# EAGLE schematic IRcircuit (EAGLE 9.4.0)

## Sheet 1 of 2
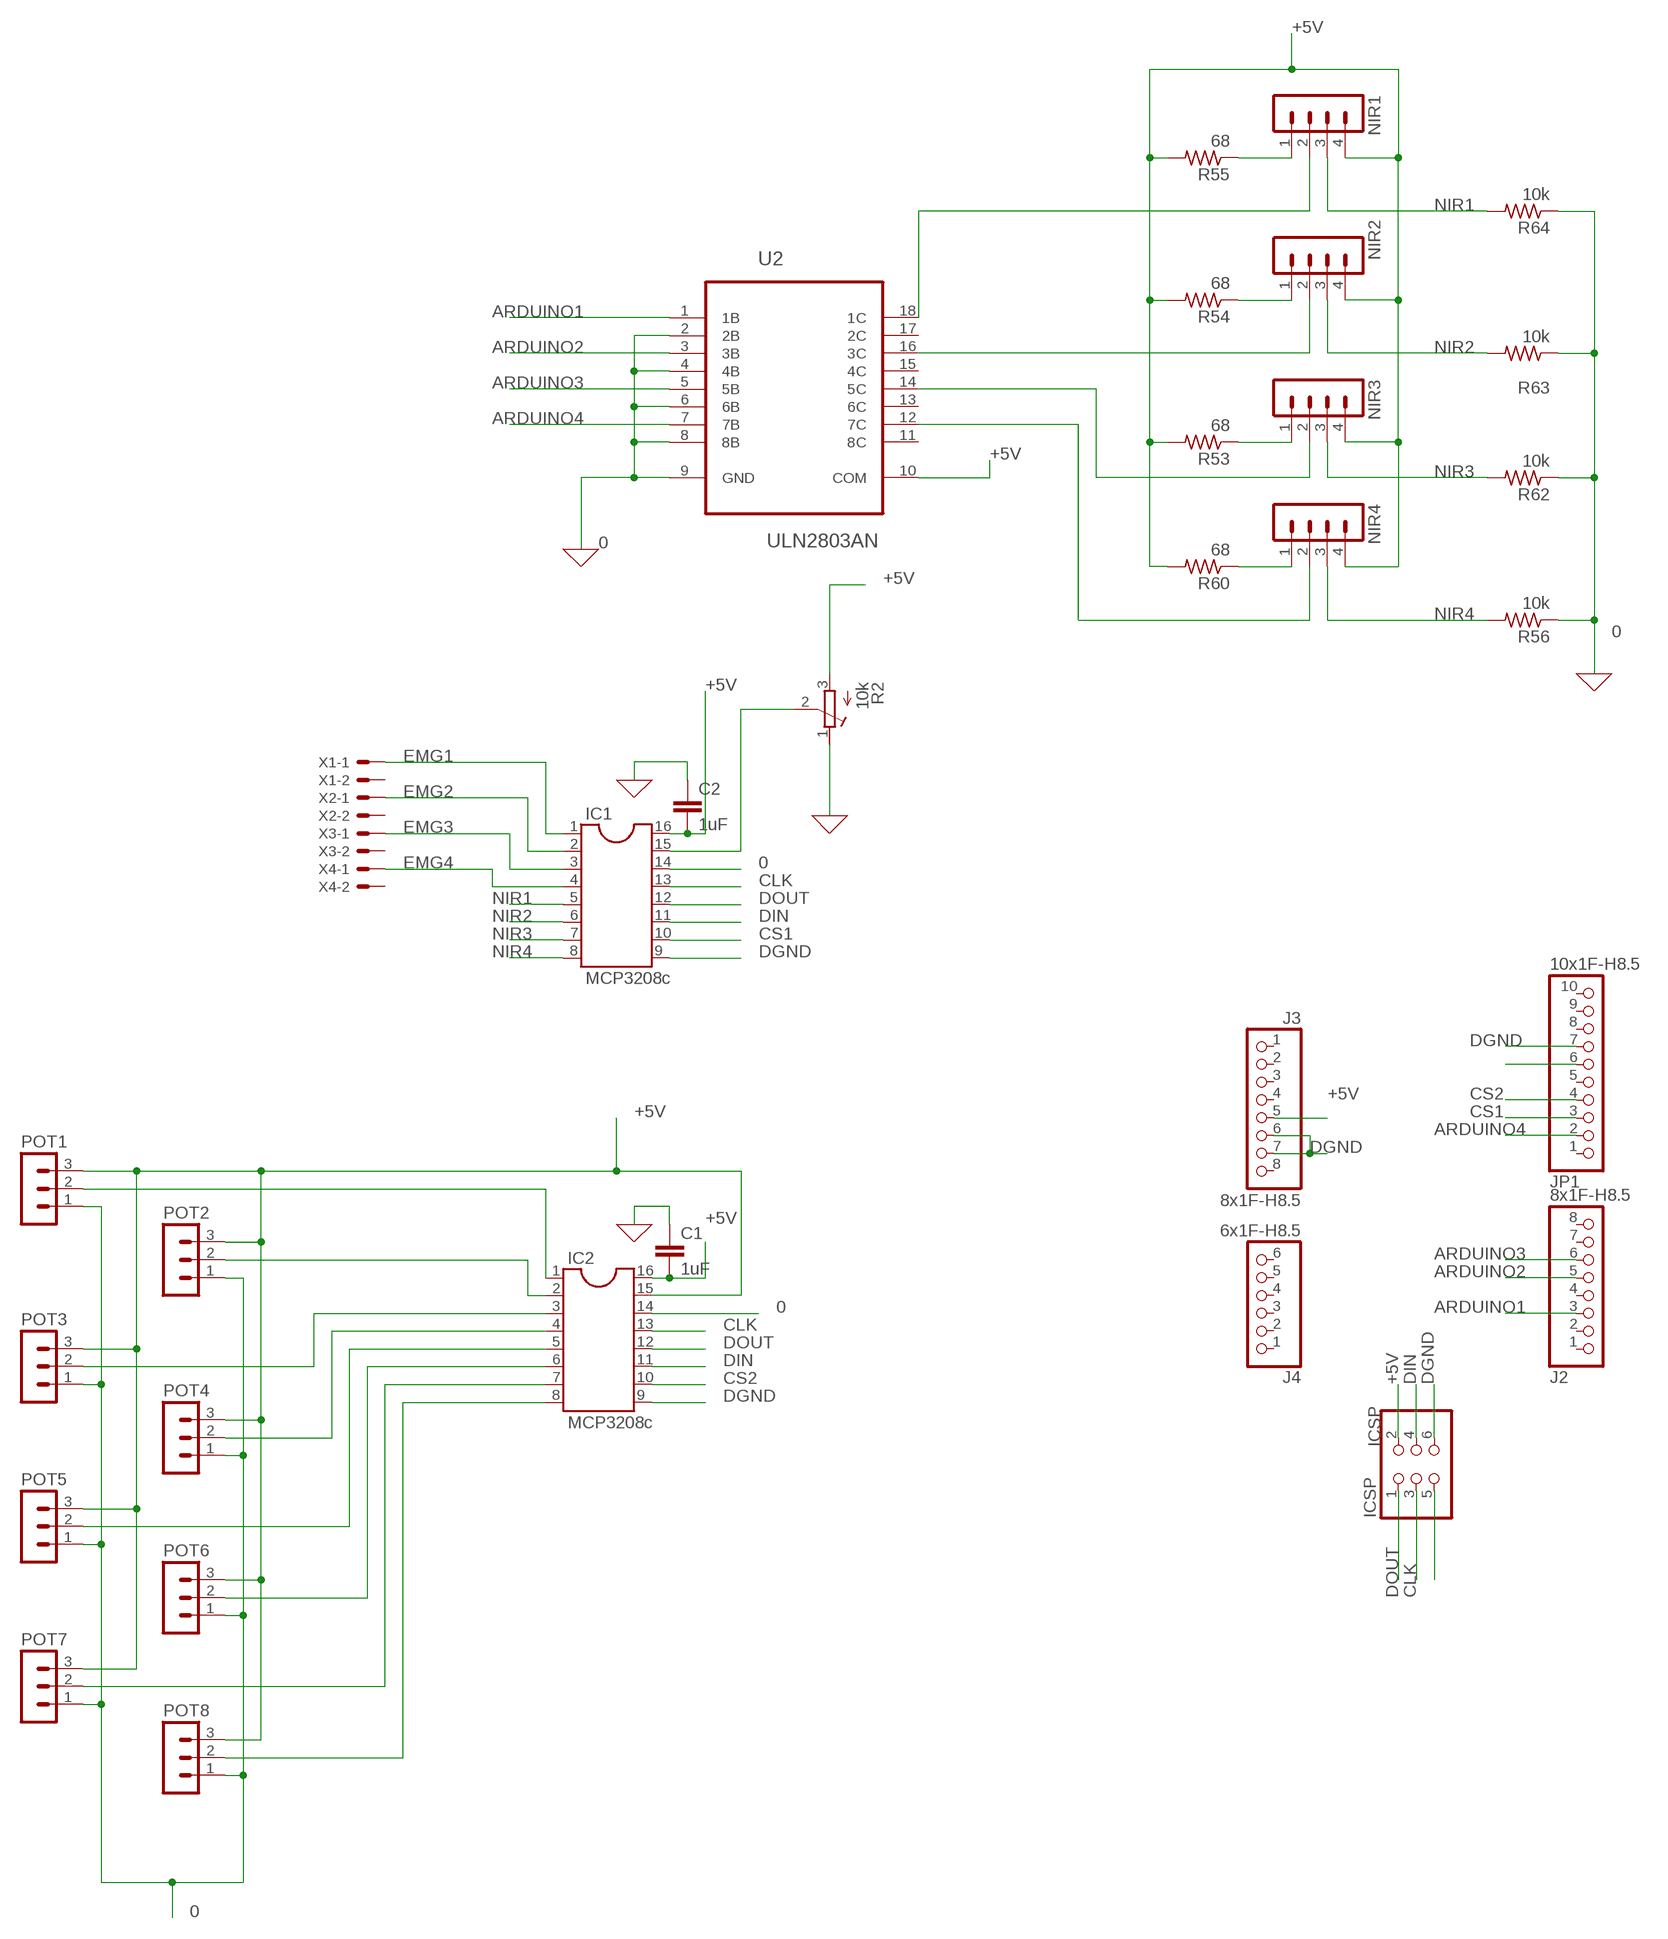
[diagram p0: schematic, sheet 1]

### Parts
C1  1uF  C-EU050-025X075  [C050-025X075]
C2  1uF  C-EU050-025X075  [C050-025X075]
IC1  MCP3208c  DIL16  [DIL16]
IC2  MCP3208c  DIL16  [DIL16]
ICSP  ICSP  PINHD-2X3  [2X03]
J2  8x1F-H8.5  PINHD-1X8  [1X08]
J3  8x1F-H8.5  PINHD-1X8  [1X08]
J4  6x1F-H8.5  PINHD-1X6  [1X06]
JP1  10x1F-H8.5  PINHD-1X10  [1X10]
NIR1  MA04-1  [MA04-1]
NIR2  MA04-1  [MA04-1]
NIR3  MA04-1  [MA04-1]
NIR4  MA04-1  [MA04-1]
POT1  MA03-1  [MA03-1]
POT2  MA03-1  [MA03-1]
POT3  MA03-1  [MA03-1]
POT4  MA03-1  [MA03-1]
POT5  MA03-1  [MA03-1]
POT6  MA03-1  [MA03-1]
POT7  MA03-1  [MA03-1]
POT8  MA03-1  [MA03-1]
R2  10k  R-TRIMMT93YA  [RTRIMT93YA]
R53  68  R-US_0207/12  [0207/12]
R54  68  R-US_0207/12  [0207/12]
R55  68  R-US_0207/12  [0207/12]
R56  10k  R-US_0207/12  [0207/12]
R60  68  R-US_0207/12  [0207/12]
R62  10k  R-US_0207/12  [0207/12]
R63  10k  R-US_0207/12  [0207/12]
R64  10k  R-US_0207/12  [0207/12]
U2  ULN2803AN  [DIP254P762X393-18]
X1  332-02  [332-02]
X2  332-02  [332-02]
X3  332-02  [332-02]
X4  332-02  [332-02]

### Nets
0: C1.1 C2.1 IC1.14 IC2.14 POT1.1 POT2.1 POT3.1 POT4.1 POT5.1 POT6.1 POT7.1 POT8.1 R2.1(E) R56.1 R62.1 R63.1 R64.1 U2.2(2B) U2.4(4B) U2.6(6B) U2.8(8B) U2.9(GND) ; supply symbol labelled GND
+5V: C1.2 C2.2 IC1.16 IC2.15 IC2.16 ICSP.2 J3.5 NIR1.4 NIR2.4 NIR3.4 NIR4.4 POT1.3 POT2.3 POT3.3 POT4.3 POT5.3 POT6.3 POT7.3 POT8.3 R2.3(A) R53.2 R54.2 R55.2 R60.2 U2.10(COM)
ARDUINO1: J2.3 U2.1(1B)
ARDUINO2: J2.5 U2.3(3B)
ARDUINO3: J2.6 U2.5(5B)
ARDUINO4: JP1.2 U2.7(7B)
CLK: IC1.13 IC2.13 ICSP.3
CS1: IC1.10 JP1.3
CS2: IC2.10 JP1.4
DGND: IC1.9 IC2.9 ICSP.6 J3.6 J3.7 JP1.7
DIN: IC1.11 IC2.11 ICSP.4
DOUT: IC1.12 IC2.12 ICSP.1
EMG1: IC1.1 X1.1
EMG2: IC1.2 X2.1
EMG3: IC1.3 X3.1
EMG4: IC1.4 X4.1
N$6: IC2.6 POT6.2
N$7: IC2.1 POT1.2
N$9: IC2.2 POT2.2
N$10: IC2.3 POT3.2
N$11: IC2.4 POT4.2
N$12: IC2.5 POT5.2
N$13: IC2.7 POT7.2
N$14: IC2.8 POT8.2
N$18: ICSP.5
N$20: IC1.15 R2.2(S)
N$21: NIR1.2 U2.18(1C)
N$22: NIR2.2 U2.16(3C)
N$23: NIR3.2 U2.14(5C)
N$24: NIR4.2 U2.12(7C)
N$26: JP1.6
N$98: NIR1.1 R55.1
N$99: NIR2.1 R54.1
N$100: NIR3.1 R53.1
N$101: NIR4.1 R60.1
NIR1: IC1.5 NIR1.3 R64.2
NIR2: IC1.6 NIR2.3 R63.2
NIR3: IC1.7 NIR3.3 R62.2
NIR4: IC1.8 NIR4.3 R56.2
Unconnected: J2.1 J2.2 J2.4 J2.7 J2.8 J3.1 J3.2 J3.3 J3.4 J3.8 J4.1 J4.2 J4.3 J4.4 J4.5 J4.6 JP1.1 JP1.5 JP1.8 JP1.9 JP1.10 U2.11(8C) U2.13(6C) U2.15(4C) U2.17(2C) X1.2 X2.2 X3.2 X4.2

## Sheet 2 of 2

## Library data of the parts
C1 C2 = rcl:C-EU: CAPACITOR, European symbol; SPICEPREFIX: C
IC1 IC2 = ic-package:DIL16: Dual In Line / Socket
ICSP = SmartPrj:PINHD-2X3: PIN HEADER
J2 J3 = SmartPrj:PINHD-1X8: PIN HEADER
J4 = SmartPrj:PINHD-1X6: PIN HEADER
JP1 = SmartPrj:PINHD-1X10: PIN HEADER
NIR1-NIR4 = con-lstb:MA04-1: PIN HEADER; OC_FARNELL: unknown; OC_NEWARK: unknown
POT1-POT8 = con-lstb:MA03-1: PIN HEADER; OC_FARNELL: unknown; OC_NEWARK: unknown
R2 = rcl:R-TRIMM: Trimm resistor; SPICEMODEL: X; SPICEPREFIXL: POT
R53-R56 R60 R62-R64 = rcl:R-US_: RESISTOR, American symbol; SPICEPREFIX: R
U2 = transistor-arrays:ULN2803AN: Darlington transistor array; MPN: ULN2803AN; OC_FARNELL: 1652422; OC_NEWARK: 21J9298; PACKAGE: DIP-18; SUPPLIER: TEXAS INSTRUMENTS
X1-X4 = con-garry:332-02: 2 Pin - 2mm Dual Row Source: www.mpe-connector.de / garry_shortform_2012.pdf

## Net classes
1 power: width 0.254 mm, drill 0.499 mm, clearance 0.254 mm
2 gnd: width 0.254 mm, drill 0.499 mm, clearance 0.254 mm
3 usbvcc: width 0.254 mm, drill 0.499 mm, clearance 0.254 mm
4 aref: width 0.254 mm, drill 0.499 mm, clearance 0.254 mm